# EAGLE design PreampBoard (EAGLE 9.6.2)
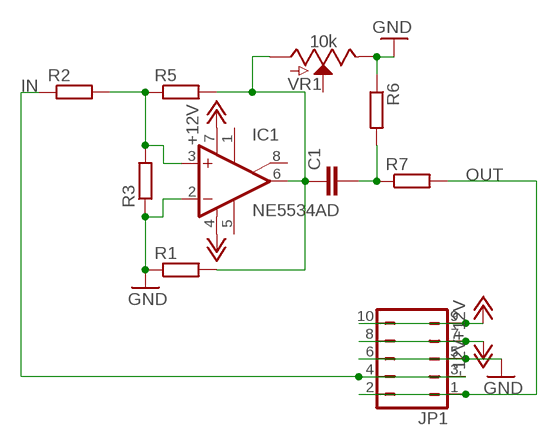
[diagram p0: schematic, sheet 1]

## Parts
C1  C-EUC0805  [C0805]
IC1  NE5534AD  [SO08]
JP1  JP5Q  [JP5Q]
R1  R-EU_R0805  [R0805]
R2  R-EU_R0805  [R0805]
R3  R-EU_R0805  [R0805]
R5  R-EU_R0805  [R0805]
R6  R-EU_R0805  [R0805]
R7  R-EU_R0805  [R0805]
VR1  10k  POTENTIOMETER-PTH-9MM-1/20W-20%  [POT-PTH-ALPS]

## Nets
+12V: IC1.7(V+) JP1.9 JP1.10
-12V: IC1.4(V-) JP1.7 JP1.8
GND: IC1.2(-IN) JP1.5 JP1.6 R1.1 R3.1 R6.1 VR1.P$1(E)
IN: JP1.3 JP1.4 R2.1
N$3: C1.1 IC1.6(OUT) R1.2 R5.2 VR1.P$3(A)
N$5: IC1.3(+IN) R2.2 R3.2 R5.1
N$6: C1.2 R6.2 R7.1
OUT: JP1.1 JP1.2 R7.2
Unconnected: IC1.1(ON) IC1.5(CMP) IC1.8(ON/CMP) VR1.P$2(S)

## Library data of the parts
C1 = resistor:C-EU: CAPACITOR, European symbol
IC1 = linear:NE5534: LOW-NOISE OPERATIONAL AMPLIFIER Source: http://focus.ti.com/lit/ds/symlink/ne5534.pdf
JP1 = jumper:JP5Q: JUMPER
R1-R3 R5-R7 = resistor:R-EU_: RESISTOR, European symbol
VR1 = SparkFun-Resistors:POTENTIOMETER: Potentiometer (Pot) Three-terminal potentiometers, with an adjustable wiper and two adjustable resistors. A pot can be used to create a configurable voltage divider, or as a variable resistor. Variants ALPS_POT and ALPS_POT_KIT - PTH, breadboard compatible, 9mm square pots Rotary Potentiometer - Linear (10k ohm) <https://www.sparkfun.com/products/9288> (COM-09288) The KIT variant exposes copper on only one side of the PTH pad, so the part can only be assembled on one side of the PCB. Useful for beginner soldering kits.; PROD_ID: RES-09177; SF_SKU: COM-09288

## Board
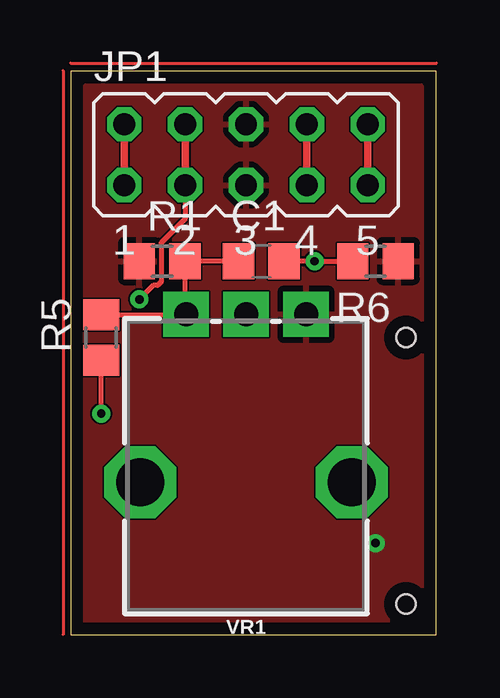
[diagram p1: board, top side]
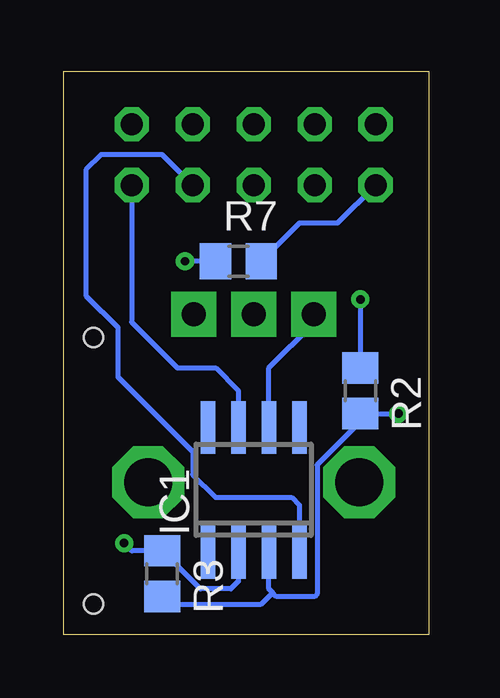
[diagram p2: board, bottom side, seen from below]

Size 15.22 x 23.48 mm. Coordinates in mm from the lower left corner, seen from the top.
Outline: 0,0 15.22,0 15.22,23.48 0,23.48 0,0
Copper layers (1*16): Top 0.035mm / dielectric 1.5mm / Bottom 0.035mm
Design rules "default *": minimum track width 6mil, minimum drill 0.35mm, track to track 3mil, track to pad 3mil, pad to pad 3mil, via to via 3mil, smd to smd 3mil, copper to edge 20mil, drill to drill 3mil, minimum pad ring 10mil, minimum via ring 8mil, stop-mask expansion 4mil, vias tented up to drill 0mil, thermal gap 10mil
Holes 0.8 mm at 13.97,1.27 13.97,12.38

### Footprints (pad centres in the part's own frame; a part is rotated, then mirrored left to right if it is on the bottom)
C0805 = smd 1.3 x 1.5: 1 -0.95,0; 2 0.95,0
SO08 = smd 0.6 x 2.2: 1 -1.905,-2.6; 2 -0.635,-2.6; 3 0.635,-2.6; 4 1.905,-2.6; 5 1.905,2.6; 6 0.635,2.6; 7 -0.635,2.6; 8 -1.905,2.6
JP5Q = drill 0.914 octagon: 1 -5.08,-1.27; 2 -5.08,1.27; 3 -2.54,-1.27; 4 -2.54,1.27; 5 0,-1.27; 6 0,1.27; 7 2.54,-1.27; 8 2.54,1.27; 9 5.08,-1.27; 10 5.08,1.27
R0805 = smd 1.3 x 1.5: 1 -0.95,0; 2 0.95,0
POT-PTH-ALPS = drill 1 pad 1.88 square: P$1 7,-2.5; P$2 7,0; P$3 7,2.5 | drill 2 octagon: P$4 0,-4.4; P$5 0,4.4

### Placement (x,y rotation side)
C1  7.94,15.56 0 top
IC1  7.3,6.03 0 bottom
JP1  7.3,20 0 top
R1  3.81,15.56 0 top
R2  2.86,10.16 270 bottom
R3  11.11,2.54 270 bottom
R5  1.27,12.38 90 top
R6  12.7,15.56 180 top
R7  7.94,15.56 0 bottom
VR1  7.3,6.35 90 top

### Tracks (layer width: path | path; a pad name or v marks a point on that pad's centre or on a via)
+12V
  Top 0.305: JP1.10 JP1.9
  Bottom 0.203: JP1.9 12.38,13.02 10.48,11.11 8.89,11.11 7.94,10.16 IC1.7
-12V
  Top 0.305: JP1.8 JP1.7
  Bottom 0.203: JP1.7 11.11,20 13.65,20 14.29,19.37 14.29,14.13 12.96,12.8 12.96,10.74 9.84,7.62 9.84,6.67 8.89,5.71 5.71,5.71 5.4,5.4 IC1.4
GND  (via drill 0.35)
  Bottom 0.203: IC1.2 7.94,2.22 8.26,1.91 9.52,1.91 R3.1 12.38,3.49 v12.7,3.81
  pour Top: 0.95,23.18 0.32,22.54 0.32,0.64 0.64,0.32 14.29,0.32 14.92,0.95 14.92,22.54 14.29,23.18
IN  (via drill 0.35)
  Top 0.203: v2.86,13.97 3.44,14.55 3.62,14.55 3.76,14.7 3.76,16.32 4.76,17.32 JP1.3
  Top 0.305: JP1.4 JP1.3
  Bottom 0.203: v2.86,13.97 R2.1
N$3
  Top 0.203: C1.1 R1.2 4.76,13.39 | 4.76,13.39 VR1.P$3 | R5.2 4.7,13.33 4.76,13.39
  Bottom 0.203: IC1.6 6.67,11.11 4.8,12.98 VR1.P$3
N$5  (via drill 0.35)
  Top 0.203: v1.27,9.21 R5.1
  Bottom 0.203: 6.51,1.75 6.35,1.59 4.76,1.59 4.66,1.69 4.66,7.08 2.86,8.88 R2.2 v1.27,9.21 | 6.51,1.75 6.67,1.91 IC1.3 | R3.2 10.79,1.27 6.99,1.27 6.51,1.75
N$6  (via drill 0.35)
  Top 0.152: C1.2
  Top 0.203: C1.2 v10.16,15.56 R6.2
  Bottom 0.203: C1.2 v10.16,15.56
OUT
  Top 0.305: JP1.2 JP1.1
  Bottom 0.152: 6.83,15.72 R7.2
  Bottom 0.203: JP1.1 3.81,17.14 5.4,17.14 6.83,15.72
(copper drawn outside any net)
  shapes: Top area x2